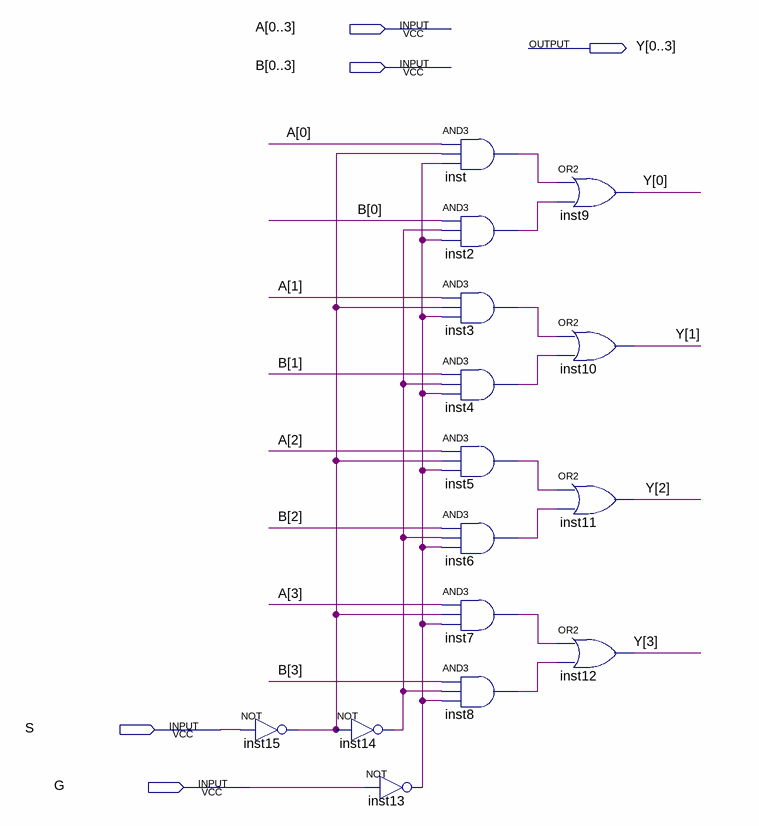
[diagram p0: schematic sheet]
// Quartus schematic 74LS157.bdf as structural Verilog: 15 symbols, 5 pins
module \74LS157  (
  input  [0:3] A,
  input  [0:3] B,
  input  S,
  input  G,
  output [0:3] Y
);

  wire inst2_out, inst3_out, inst4_out, inst5_out, inst6_out, inst7_out, inst8_out, inst13_out, inst14_out,
       inst15_out, inst_out;

  not inst15 (inst15_out, S);
  not inst14 (inst14_out, inst15_out);
  not inst13 (inst13_out, G);
  and inst (inst_out, A[0], inst15_out, inst13_out);
  and inst2 (inst2_out, B[0], inst14_out, inst13_out);
  and inst3 (inst3_out, A[1], inst15_out, inst13_out);
  and inst4 (inst4_out, B[1], inst14_out, inst13_out);
  and inst5 (inst5_out, A[2], inst15_out, inst13_out);
  and inst6 (inst6_out, B[2], inst14_out, inst13_out);
  and inst7 (inst7_out, A[3], inst15_out, inst13_out);
  and inst8 (inst8_out, B[3], inst14_out, inst13_out);
  or inst9 (Y[0], inst_out, inst2_out);
  or inst10 (Y[1], inst3_out, inst4_out);
  or inst11 (Y[2], inst5_out, inst6_out);
  or inst12 (Y[3], inst7_out, inst8_out);
endmodule
